# Altium schematic sheet Power.SchDoc
size 420 x 297 mm; CompanyName3: МГТУ им. Н.Э. Баумана; Address1: Address1; Address2: Address2; Address3: Address3; Address4: Address4; DocumentNumber: Э3; Revision: р; SheetNumber: 1; SheetTotal: 5; Title1str: Ретранслятор Ethernet; DocumentType: Схема электрическая принципиальная; FirstReferrence: АБВГ.123456.001; CompanyName2: Кафедра СМ5; CompanyName1: Группа СМ5-71
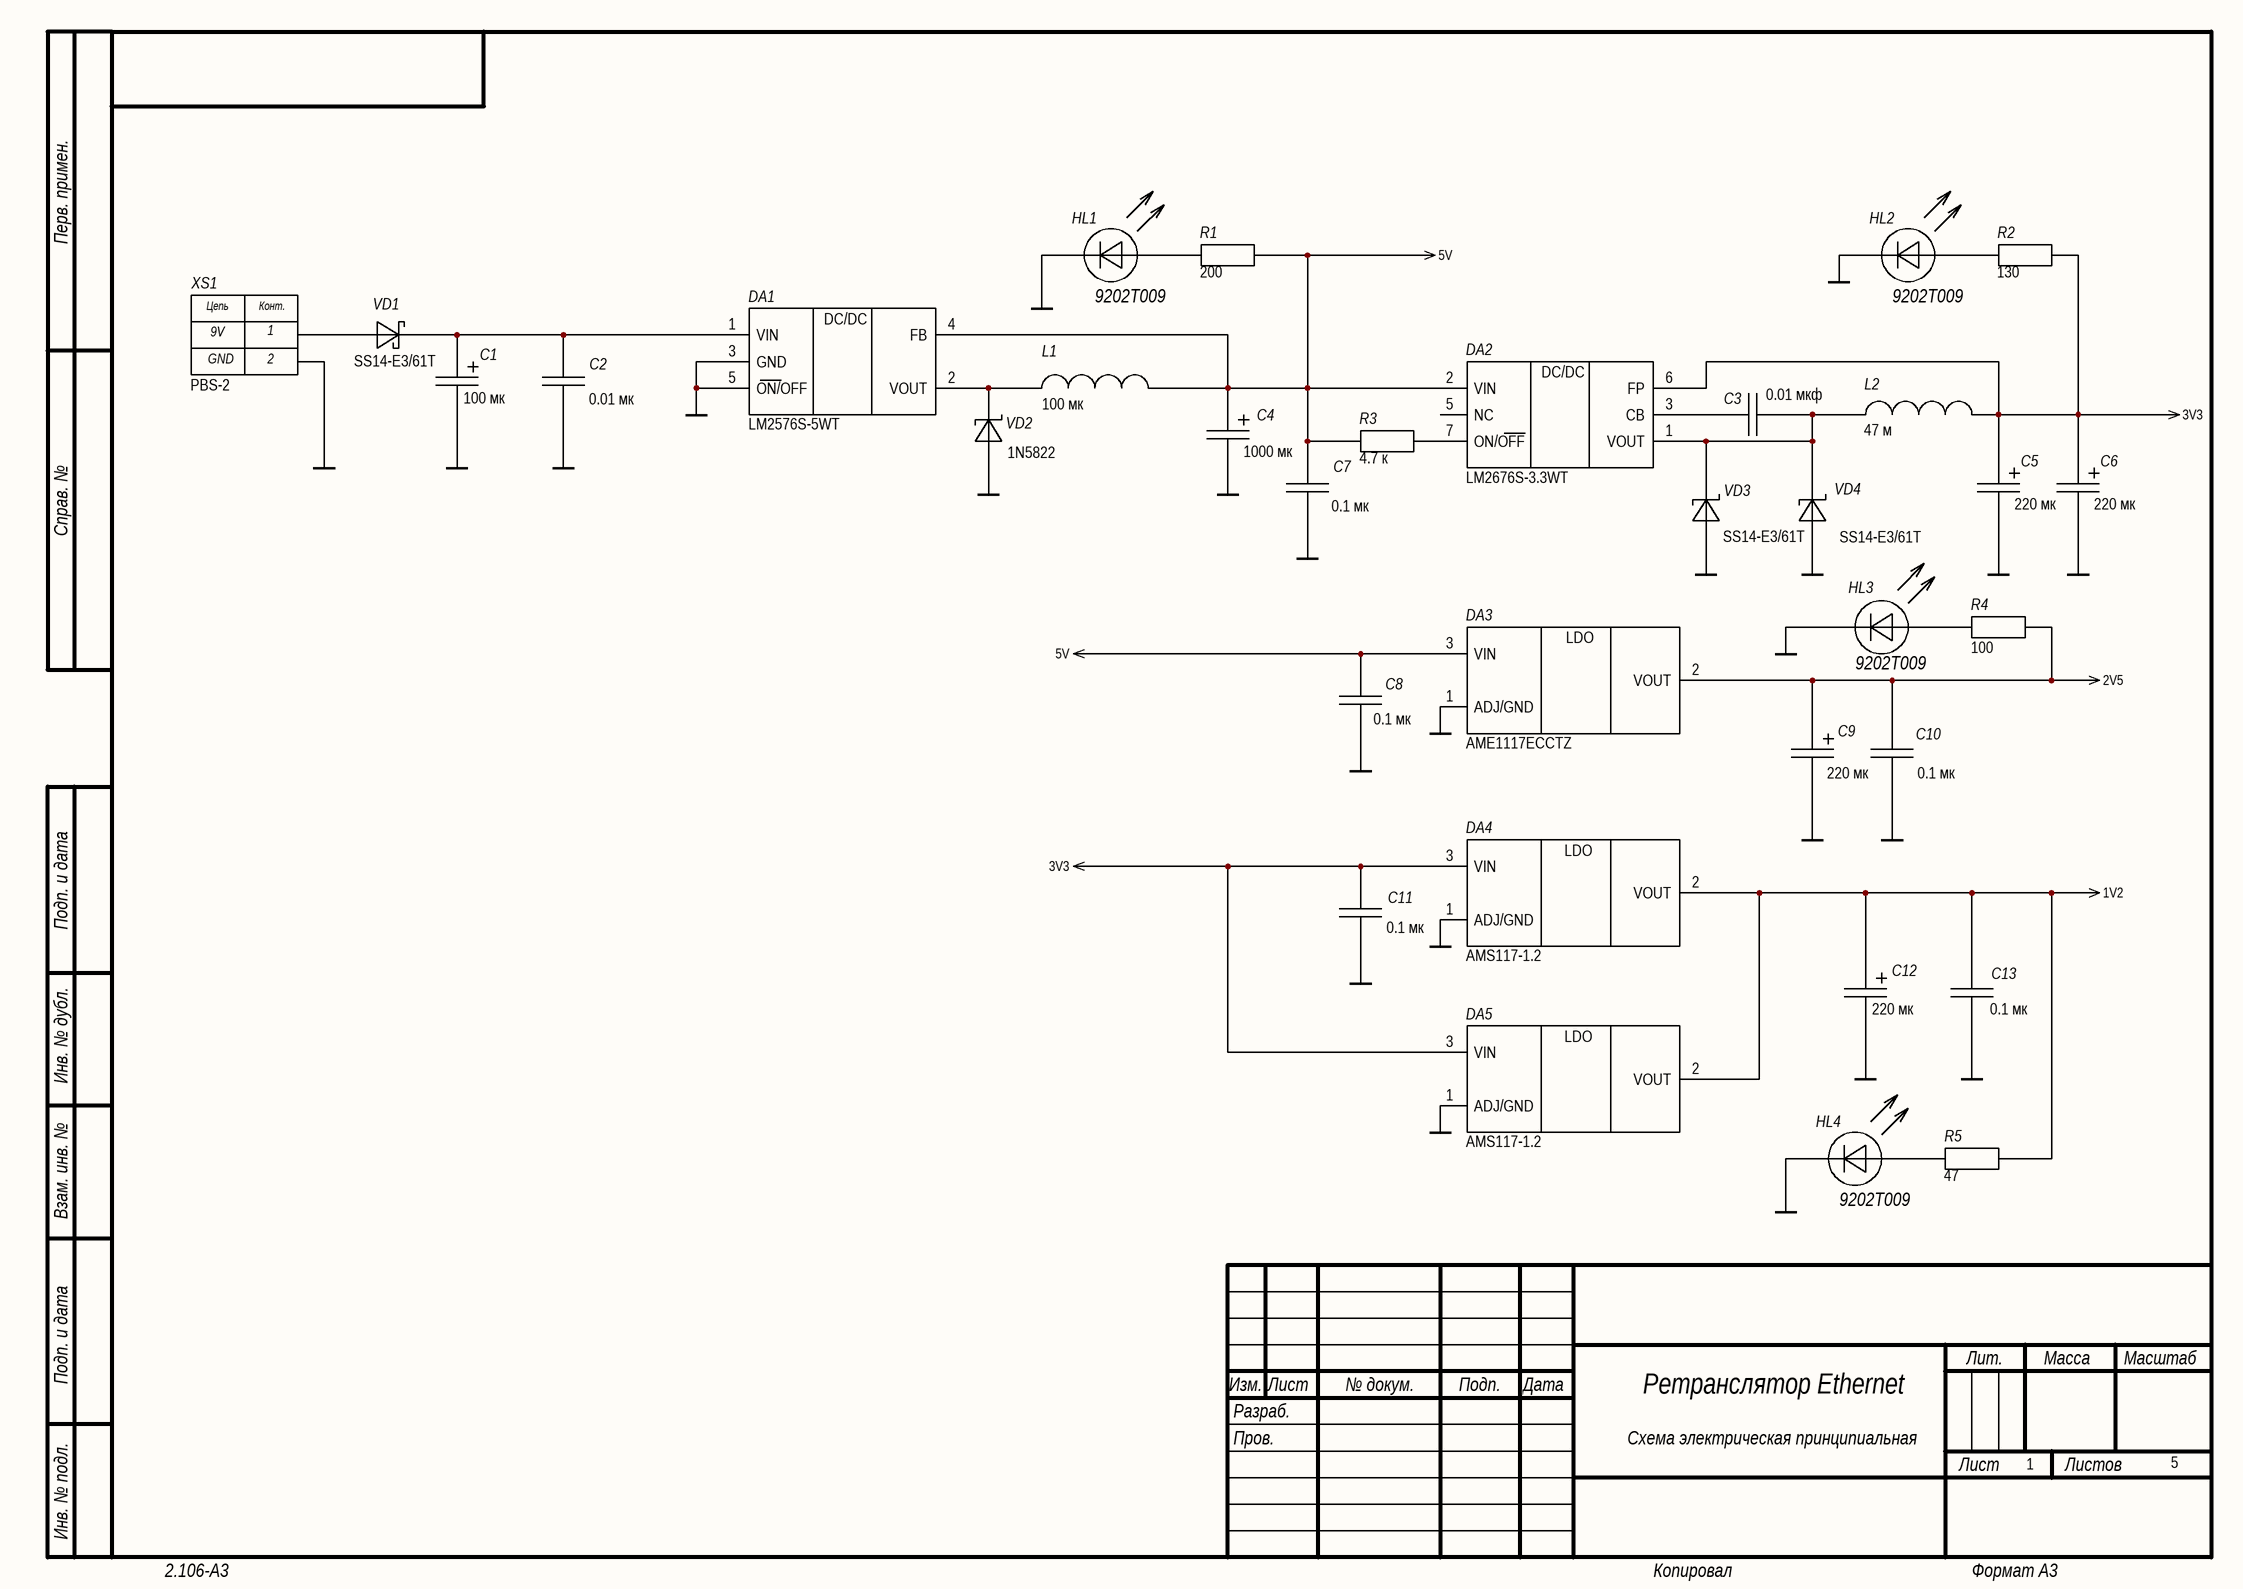
[diagram p0: Power.SchDoc]

## Parts
C1  (no value)
C2  (no value)
C3  (no value)
C4  (no value)
C5  (no value)
C6  (no value)
C7  (no value)
C8  (no value)
C9  (no value)
C10  (no value)
C11  (no value)
C12  (no value)
C13  (no value)
DA1  LM2576S-5WT
DA2  LM2676S-3.3WT
DA3  AME1117ECCTZ
DA4  AMS117-1.2
DA5  AMS117-1.2
HL1  9202T009
HL2  9202T009
HL3  9202T009
HL4  9202T009
L1  L  (value not drawn)
L2  L  (value not drawn)
R1  200
R2  130
R3  4.7 к
R4  100
R5  47
VD1  *  (value not drawn)
VD2  *  (value not drawn)
VD3  *  (value not drawn)
VD4  *  (value not drawn)
XS1  Header  (value not drawn)

## Nets
1V2: C12.2 C13.2 DA4.2(VOUT) DA5.2(VOUT) R5.1
2V5: C9.2 C10.2 DA3.2(VOUT) R4.1
3V3: C5.2 C6.2 C11.2 DA2.6(FP) DA4.3(VIN) DA5.3(VIN) L2.2 R2.1
5V: C4.2 C7.2 C8.2 DA1.4(FB) DA2.2(VIN) DA3.3(VIN) L1.2 R1.1 R3.2
GND: C1.1 C2.1 C5.1 C6.1 C7.1 C8.1 C9.1 C10.1 C11.1 C12.1 C13.1 DA1.3(GND) DA1.5(ON/OFF) DA3.1(ADJ/GND) DA4.1(ADJ/GND) DA5.1(ADJ/GND) HL1.2 HL2.2 HL3.2 HL4.2 VD2.1 VD3.1 VD4.1 XS1.2
NetC1_2: C1.2 C2.2 DA1.1(VIN) VD1.2
NetC3_1: C3.1 DA2.1(VOUT) L2.1 VD3.2 VD4.2
NetC3_2: C3.2 DA2.3(CB)
NetDA1_2: DA1.2(VOUT) L1.1 VD2.2
NetDA2_7: DA2.7(ON/OFF) R3.1
NetHL1_1: HL1.1 R1.2
NetHL2_1: HL2.1 R2.2
NetHL3_1: HL3.1 R4.2
NetHL4_1: HL4.1 R5.2
NetVD1_1: VD1.1 XS1.1

Not connected (* = marked no-connect by the designer): C4 1; DA2 5(NC)

## Notes on the sheet
- PBS-2
- SS14-E3/61T
- (near C1) 100 мк
- (near C2) 0.01 мк
- (near VD2) 1N5822
- (near L1) 100 мк
- (near C7) 1000 мк
- (near C3) 0.01 мкф
- (near L2) 47 м
- (near C7) 0.1 мк
- 220 мк
- (near C6) 220 мк
- (near VD4) SS14-E3/61T
- (near C8) 0.1 мк
- (near C10) 0.1 мк
- 0.1 мк
- (near C12) 220 мк
- (near C13) 0.1 мк
- 1
- 5
- Labels drawn without touching a wire or pin: GND
- Перв. примен.
- Справ. №
- Подп. и дата
- Инв. № дубл.
- Взам. инв. №
- Разраб.
- Изм.
- Лист
- № докум.
- Подп.
- Дата
- Ретранслятор Ethernet
- Лит.
- Масса
- Масштаб
- Пров.
- Схема электрическая принципиальная
- Листов
- Инв. № подл.
- 2.106-A3
- Копировал
- Формат А3
- (in symbol AME1117ACCTZ_LDO_1.2v) LDO
- (in symbol AME1117ECCTZ_LDO_1.8v) LDO
- (in symbol Header) Цепь; Конт.; 9V; GND
- (in symbol LM2576_DCDC) DC/DC
- (in symbol LM2676_LDO_3v3) DC/DC

## Library data of the parts
C1 C4-C6 C9 C12 = C_POL: ValueType: Конденсатор
C2 C3 C7 C8 C10 C11 C13 = C: ValueType: Конденсатор
DA1 = LM2576_DCDC
DA2 = LM2676_LDO_3v3
DA3 = AME1117ECCTZ_LDO_1.8v
DA4 DA5 = AME1117ACCTZ_LDO_1.2v
HL1-HL4 = Led_blue: ValueManufacturer: Foryard; ValueManufacturerPartNumber: fyls-0603urc; Temp: -40 C... +85 C; Value: Cиний; ValueType: Светодиод; URL: *; Case: 0603; ValueDescription: Светодиод
R1-R5 = R
VD1 = shotki: ValueManufacturer: On Semiconductor; ValueManufacturerPartNumber: BAT54HT1G; Value: *; URL: *; Temp: *; Case: *; ValueType: *; ValueDescription: *
VD2-VD4 = Diode: ValueManufacturer: On Semiconductor; ValueManufacturerPartNumber: BAT54HT1G; Value: *; URL: *; Temp: *; Case: *; ValueType: *; ValueDescription: *